# EAGLE design robot (EAGLE 6.4)
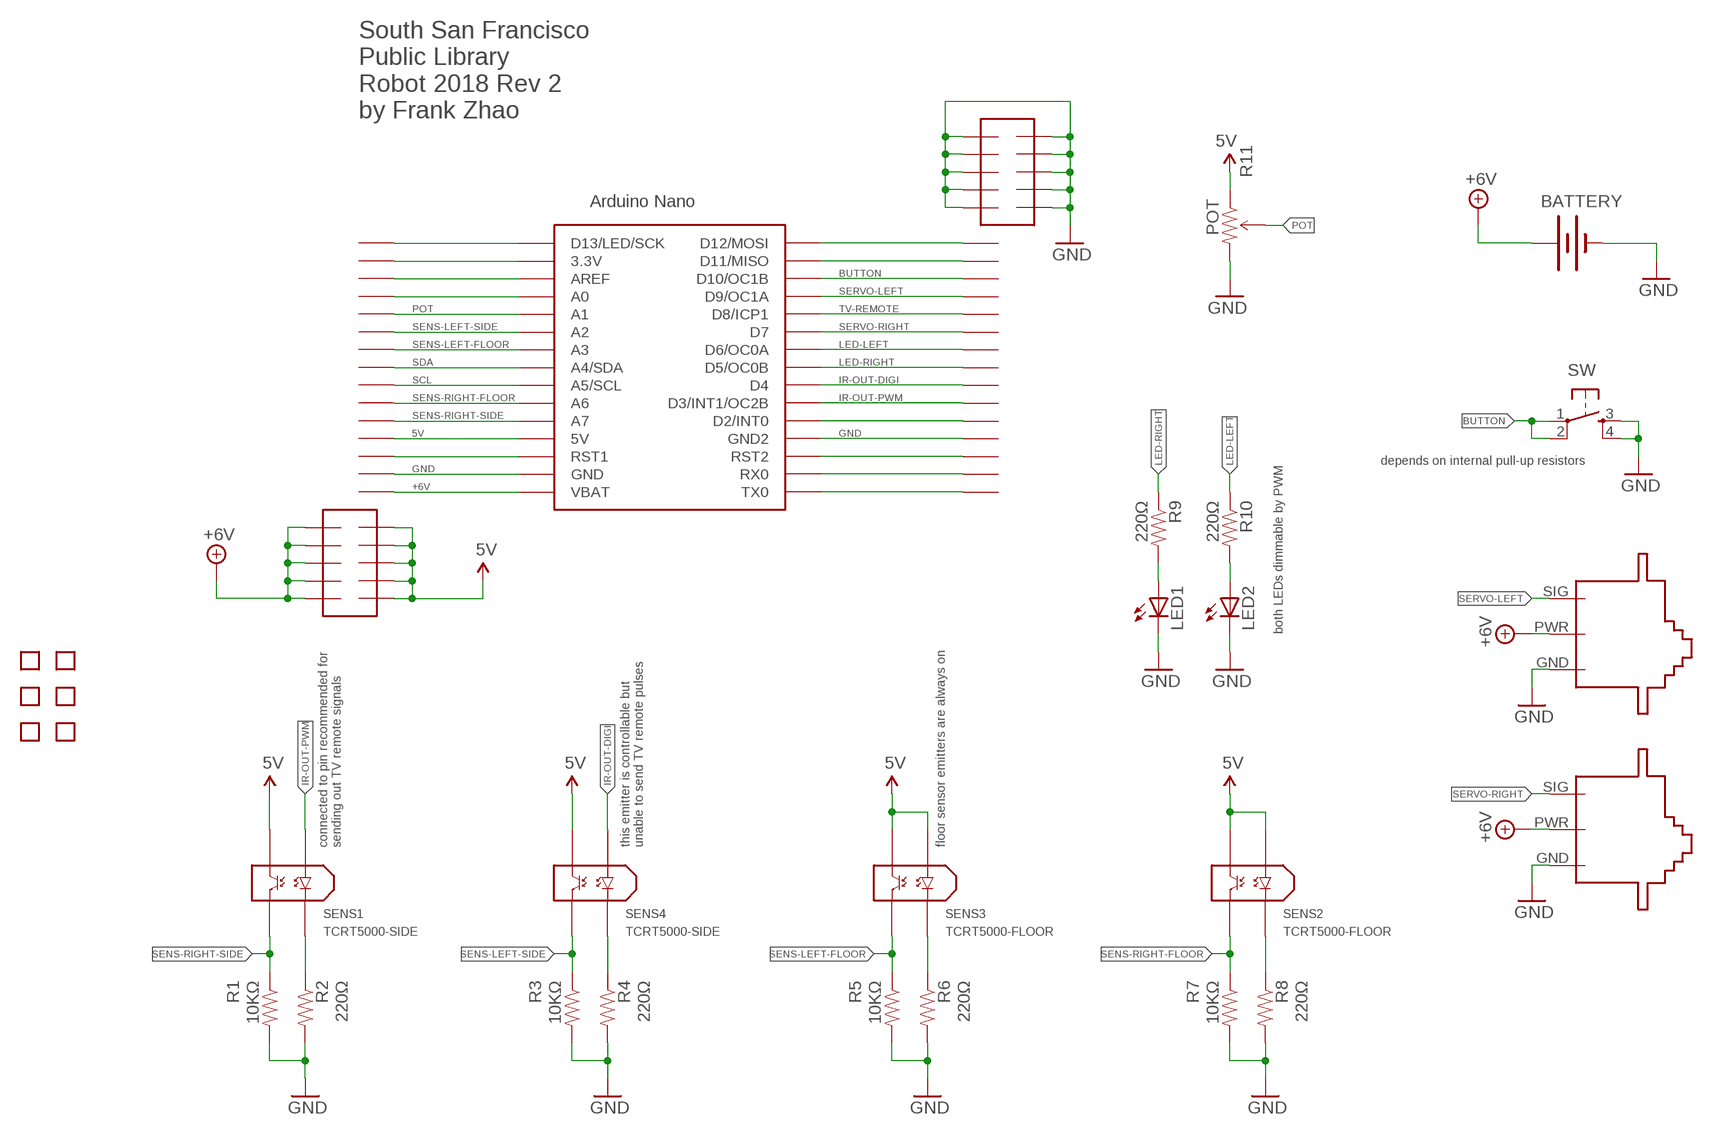
[diagram p0: schematic, sheet 1]

## Parts
BATTERY  BATTERY-WIRE-CONN  [BATT-WIRE-CONN]
LED1  LED5MM  [LED5MM]
LED2  LED5MM  [LED5MM]
M1  SERVO-FLIPPED  [SERVO-FLIPPED]
M2  SERVO-1  [SERVO]
R1  10KΩ  RESISTORAXIAL-0.3  [AXIAL-0.3]
R2  220Ω  RESISTORAXIAL-0.3  [AXIAL-0.3]
R3  10KΩ  RESISTORAXIAL-0.3  [AXIAL-0.3]
R4  220Ω  RESISTORAXIAL-0.3  [AXIAL-0.3]
R5  10KΩ  RESISTORAXIAL-0.3  [AXIAL-0.3]
R6  220Ω  RESISTORAXIAL-0.3  [AXIAL-0.3]
R7  10KΩ  RESISTORAXIAL-0.3  [AXIAL-0.3]
R8  220Ω  RESISTORAXIAL-0.3  [AXIAL-0.3]
R9  220Ω  RESISTORAXIAL-0.3  [AXIAL-0.3]
R10  220Ω  RESISTORAXIAL-0.3  [AXIAL-0.3]
R11  POT  TRIMPOTPTH  [TRIM_POT_PTH]
SENS1  TCRT5000-SIDE  [TCRT5000-SIDE]
SENS2  TCRT5000-FLOOR  [TCRT5000-FLOOR]
SENS3  TCRT5000-FLOOR  [TCRT5000-FLOOR]
SENS4  TCRT5000-SIDE  [TCRT5000-SIDE]
SW  TAC_SWITCHPTH  [TACTILE-PTH]
U5  NANO  [NANO]
U$1  ROBOT-BODY-HOLDER  [ROBOT-BODY-HOLDER]
U$8  PROTO-AREA-MID  [PROTO-AREA-1]
U$9  TEXT-INFO  [TEXT-INFO]
U$10  HOLE  [HOLE-2MM]
U$11  HOLE  [HOLE-2MM]
U$12  HOLE  [HOLE-2MM]
U$13  HOLE  [HOLE-2MM]
X1  NANO-HEADER-SURROUND  [NANO-HEADER-SURROUND]
X2  NANO-HEADER-SURROUND  [NANO-HEADER-SURROUND]

## Nets
5V: R11.1(CCW) SENS1.COL SENS2.AN SENS2.COL SENS3.AN SENS3.COL SENS4.COL U5.5V X2.4 X2.E6 X2.E7 X2.E8 X2.E9 X2.E10
+6V: BATTERY.POS(+) M1.PWR M2.PWR U5.RAW(VBAT) X2.1 X2.E1 X2.E2 X2.E3 X2.E4 X2.E5
A0: U5.A0 X2.12
BUTTON: SW.1 SW.2 U5.D10(D10/OC1B) X1.3
GND: BATTERY.NEG(-) LED1.K(C) LED2.K(C) M1.GND M2.GND R1.P$2 R2.P$2 R3.P$2 R4.P$2 R5.P$2 R6.P$2 R7.P$2 R8.P$2 R11.3(CW) SW.3 SW.4 U5.GND U5.GND1(GND2) X1.12 X1.E1 X1.E2 X1.E3 X1.E4 X1.E5 X1.E6 X1.E7 X1.E8 X1.E9 X1.E10 X2.2
IR-OUT-DIGI: SENS4.AN U5.D4 X1.9
IR-OUT-PWM: SENS1.AN U5.D3(D3/INT1/OC2B) X1.10
LED-LEFT: R10.P$1 U5.D6(D6/OC0A) X1.7
LED-RIGHT: R9.P$1 U5.D5(D5/OC0B) X1.8
N$1: R2.P$1 SENS1.CAT
N$2: R4.P$1 SENS4.CAT
N$3: R6.P$1 SENS3.CAT
N$4: R8.P$1 SENS2.CAT
N$9: LED1.A R9.P$2
N$10: LED2.A R10.P$2
N$11: U5.3.3V X2.14
N$12: U5.AREF X2.13
N$15: U5.RST(RST1) X2.3
N$21: U5.D13(D13/LED/SCK) X2.15
N$26: U5.D12(D12/MOSI) X1.1
N$27: U5.D11(D11/MISO) X1.2
N$36: U5.D2(D2/INT0) X1.11
N$38: U5.RST1(RST2) X1.13
N$39: U5.RX0 X1.14
N$40: U5.TX0 X1.15
POT: R11.2(WIPER) U5.A1 X2.11
SCL: U5.A5(A5/SCL) X2.7
SDA: U5.A4(A4/SDA) X2.8
SENS-LEFT-FLOOR: R5.P$1 SENS3.EM U5.A3 X2.9
SENS-LEFT-SIDE: R3.P$1 SENS4.EM U5.A2 X2.10
SENS-RIGHT-FLOOR: R7.P$1 SENS2.EM U5.A6 X2.6
SENS-RIGHT-SIDE: R1.P$1 SENS1.EM U5.A7 X2.5
SERVO-LEFT: M2.SIG U5.D9(D9/OC1A) X1.4
SERVO-RIGHT: M1.SIG U5.D7 X1.6
TV-REMOTE: U5.D8(D8/ICP1) X1.5

## Notes on the sheet
- depends on internal pull-up resistors
- both LEDs dimmable by PWM
- connected to pin recommended for
  sending out TV remote signals
- this emitter is controllable but
  unable to send TV remote pulses
- floor sensor emitters are always on

## Library data of the parts
BATTERY = robot:BATTERY: Battery Holders Various common sizes : AA, AAA, 20mm coin cell and 12mm coin cell.
LED1 LED2 = robot:LED: LEDs Standard schematic elements and footprints for 5mm, 3mm, 1206, and 0603 sized LEDs. 5mm - Spark Fun Electronics SKU : COM-00529 (and others)
M1 M2 = robot:SERVO
R1-R10 = robot:RESISTOR: Resistor Basic schematic elements and footprints for 0603, 1206, and PTH resistors.
R11 = robot:TRIMPOT
SENS1-SENS4 = robot:TCRT5000
SW = robot:TAC_SWITCH: Momentary Switch Button commonly used for reset or general input. Spark Fun Electronics SKU : COM-00097
U5 = robot:NANO: Arduino Nano
U$1 = robot:ROBOT-BODY-HOLDER
U$8 = robot:PROTO-AREA
U$9 = robot:TEXT-INFO
U$10-U$13 = robot:HOLE
X1 X2 = robot:NANO-HEADER-SURROUND

## Board
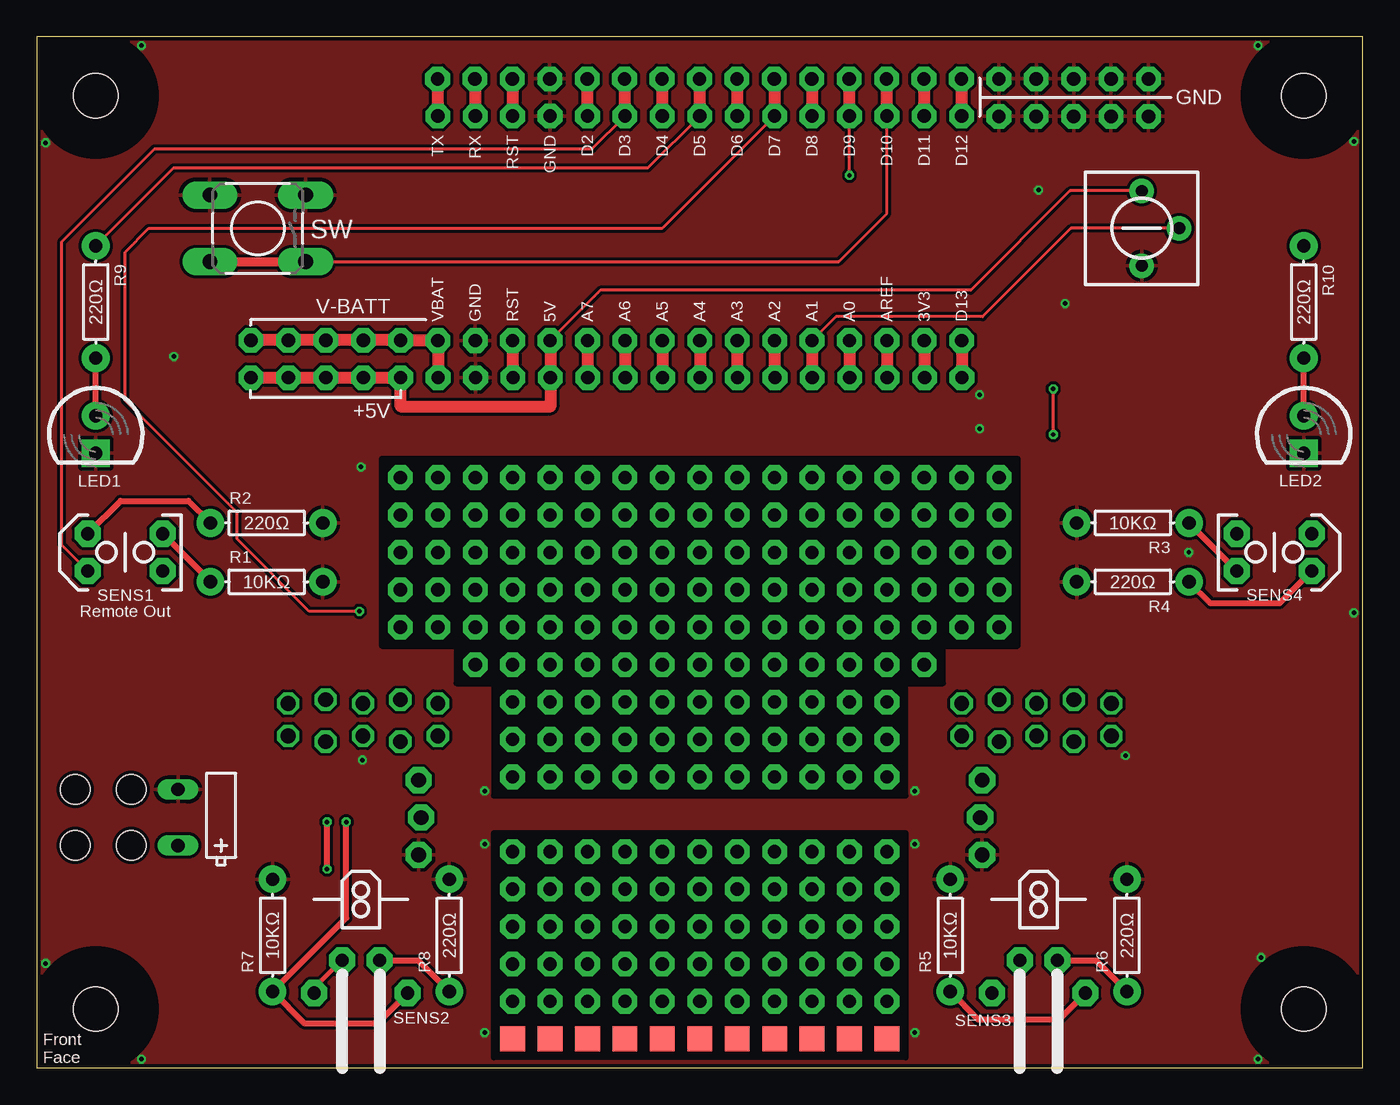
[diagram p1: board, top side]
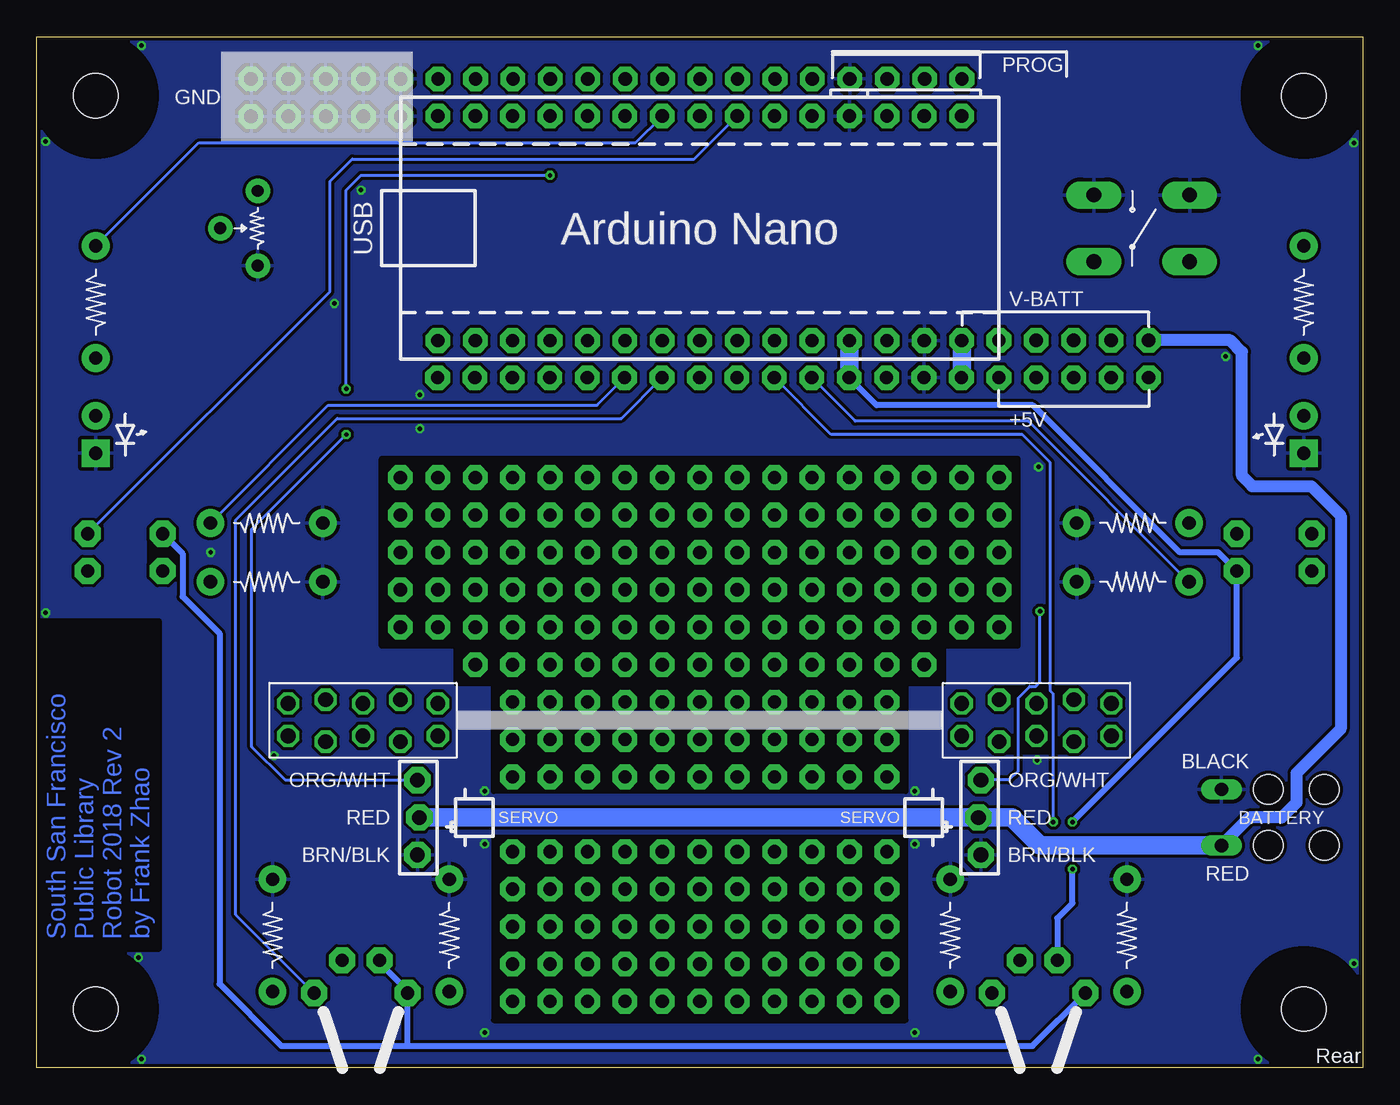
[diagram p2: board, bottom side, seen from below]

Size 90 x 70 mm. Coordinates in mm from the lower left corner, seen from the top.
Outline: 0,0 90,0 90,70 0,70 0,0
Copper layers (1*16): Top 0.035mm / dielectric 1.5mm / Bottom 0.035mm
Design rules "Fusion_eagle_rule_v1.1_TentedVias3": minimum track width 6mil, minimum drill 0.3mm, track to track 7mil, track to pad 7mil, pad to pad 7mil, via to via 7mil, smd to smd 0mil, copper to edge 10mil, drill to drill 10mil, minimum pad ring 10mil, minimum via ring 6mil, stop-mask expansion 2mil, vias tented up to drill 25mil, thermal gap 10mil
bRestrict: 3 lines

### Footprints (pad centres in the part's own frame; a part is rotated, then mirrored left to right if it is on the bottom)
BATT-WIRE-CONN = drill 0.9 long: NEG -6.985,-1.905; POS -6.985,1.905 | hole 2: 0,1.905; 0,-1.905; -3.81,1.905; -3.81,-1.905
LED5MM = drill 0.9 pad 1.88: A -1.27,0 | drill 0.9 pad 1.88 square: K 1.27,0
SERVO-FLIPPED = drill 1 pad 1.778 octagon: GND 2.54,0.089; PWR 0,-0.089; SIG -2.54,0.089
SERVO = drill 1 pad 1.778 octagon: GND -2.54,0.064; PWR 0,-0.064; SIG 2.54,0.064
AXIAL-0.3 = drill 0.9 pad 1.88: P$1 -3.81,0; P$2 3.81,0
TRIM_POT_PTH = drill 0.813 pad 1.676: 1 -2.54,0; 2 0,2.54; 3 2.54,0
TCRT5000-SIDE = drill 0.9 pad 1.778 octagon: AN -2.54,-1.27; CAT -2.54,1.27; COL 2.54,-1.27; EM 2.54,1.27
TCRT5000-FLOOR = drill 0.9 pad 1.778 octagon: AN -1.27,7.303; CAT 1.27,7.303; COL -3.175,5.08; EM 3.175,5.08
TACTILE-PTH = drill 1 pad 1.88 long: 1 -3.251,2.261; 2 3.251,2.261; 3 -3.251,-2.261; 4 3.251,-2.261
NANO = drill 0.9 pad 1.676 octagon: 3.3V -7.62,15.24; 5V -7.62,-10.16; A0 -7.62,10.16; A1 -7.62,7.62; A2 -7.62,5.08; A3 -7.62,2.54; A4 -7.62,0; A5 -7.62,-2.54; A6 -7.62,-5.08; A7 -7.62,-7.62; AREF -7.62,12.7; D2 7.62,-7.62; D3 7.62,-5.08; D4 7.62,-2.54; D5 7.62,0; D6 7.62,2.54; D7 7.62,5.08; D8 7.62,7.62; D9 7.62,10.16; D10 7.62,12.7; D11 7.62,15.24; D12 7.62,17.78; D13 -7.62,17.78; GND -7.62,-15.24; GND1 7.62,-10.16; RAW -7.62,-17.78; RST -7.62,-12.7; RST1 7.62,-12.7; RX0 7.62,-15.24; TX0 7.62,-17.78
ROBOT-BODY-HOLDER = drill 1 octagon: 1 -27.94,1.143; 2 -25.4,1.397; 3 -22.86,1.143; 4 -20.32,1.397; 5 -17.78,1.143; 6 17.78,1.143; 7 20.32,1.397; 8 22.86,1.143; 9 25.4,1.397; 10 27.94,1.143; 11 27.94,-1.067; 12 25.4,-1.448; 13 22.86,-1.067; 14 20.32,-1.448; 15 17.78,-1.067; 16 -17.78,-1.067; 17 -20.32,-1.448; 18 -22.86,-1.067; 19 -25.4,-1.448; 20 -27.94,-1.067
PROTO-AREA-1 = drill 0.9 pad 1.676 octagon: 1 0,0; 2 2.54,0; 3 5.08,0; 4 7.62,0; 5 10.16,0; 6 12.7,0; 7 12.7,-2.54; 8 12.7,-5.08; 9 12.7,-7.62; 10 12.7,2.54; 11 12.7,5.08; 12 15.24,0; 13 -2.54,0; 14 -5.08,0; 15 -7.62,0; 16 -10.16,0; 17 -12.7,0; 18 15.24,-2.54; 19 15.24,-5.08; 20 15.24,-7.62; 21 15.24,2.54; 22 15.24,5.08; 23 17.78,0; 24 17.78,-2.54; 25 17.78,-5.08; 26 12.7,-20.32; 27 17.78,2.54; 28 17.78,5.08; 29 20.32,0; 30 20.32,-2.54; 31 20.32,-5.08; 32 2.54,-20.32; 33 20.32,2.54; 34 20.32,5.08; 35 -20.32,0; 36 -20.32,-2.54; 37 -20.32,-5.08; 38 5.08,-20.32; 39 2.54,2.54; 40 2.54,5.08; 41 -17.78,0; 42 -17.78,-2.54; 43 -17.78,-5.08; 44 7.62,-20.32; 45 -17.78,2.54; 46 5.08,2.54; 47 -15.24,0; 48 -15.24,-2.54; 49 -15.24,-5.08; 50 -15.24,-7.62; 51 -15.24,2.54; 52 -15.24,5.08; 53 5.08,5.08; 54 7.62,2.54; 55 7.62,5.08; 56 10.16,2.54; 57 10.16,5.08; 58 -7.62,2.54; 59 -7.62,5.08; 60 -5.08,2.54; 61 -5.08,5.08; 62 -2.54,2.54; 63 -2.54,5.08; 64 0,2.54; 65 0,5.08; 66 2.54,-2.54; 67 2.54,-5.08; 68 2.54,-7.62; 69 5.08,-2.54; 70 5.08,-5.08; 71 5.08,-7.62; 72 7.62,-2.54; 73 7.62,-5.08; 74 7.62,-7.62; 75 10.16,-2.54; 76 10.16,-5.08; 77 10.16,-7.62; 78 -7.62,-2.54; 79 -7.62,-5.08; 80 -7.62,-7.62; 81 -5.08,-2.54; 82 -5.08,-5.08; 83 -5.08,-7.62; 84 -2.54,-2.54; 85 -2.54,-5.08; 86 -2.54,-7.62; 87 0,-2.54; 88 0,-5.08; 89 0,-7.62; 90 -10.16,2.54; 91 -12.7,2.54; 92 -12.7,5.08; 93 -10.16,5.08; 94 -10.16,-2.54; 95 -10.16,-5.08; 96 -10.16,-7.62; 97 -12.7,-7.62; 98 -12.7,-5.08; 99 -12.7,-2.54; 100 12.7,-10.16; 101 2.54,-10.16; 102 5.08,-10.16; 103 7.62,-10.16; 104 10.16,-10.16; 105 -7.62,-10.16; 106 -5.08,-10.16; 107 -2.54,-10.16; 108 0,-10.16; 109 -10.16,-10.16; 110 -12.7,-10.16; 111 12.7,-12.7; 112 2.54,-12.7; 113 5.08,-12.7; 114 7.62,-12.7; 115 10.16,-12.7; 116 -7.62,-12.7; 117 -5.08,-12.7; 118 -2.54,-12.7; 119 0,-12.7; 120 -10.16,-12.7; 121 -12.7,-12.7; 122 10.16,-20.32; 123 -7.62,-20.32; 124 -5.08,-20.32; 125 -2.54,-20.32; 126 0,-20.32; 127 -10.16,-20.32; 128 -12.7,-20.32; 129 12.7,-15.24; 130 2.54,-15.24; 131 5.08,-15.24; 132 7.62,-15.24; 133 10.16,-15.24; 134 -7.62,-15.24; 135 -5.08,-15.24; 136 -2.54,-15.24; 137 0,-15.24; 138 -10.16,-15.24; 139 -12.7,-15.24; 140 12.7,-22.86; 141 2.54,-22.86; 142 5.08,-22.86; 143 7.62,-22.86; 144 10.16,-22.86; 145 -7.62,-22.86; 146 -5.08,-22.86; 147 -2.54,-22.86; 148 0,-22.86; 149 -10.16,-22.86; 150 -12.7,-22.86; 151 12.7,-25.4; 152 2.54,-25.4; 153 5.08,-25.4; 154 7.62,-25.4; 155 10.16,-25.4; 156 -7.62,-25.4; 157 -5.08,-25.4; 158 -2.54,-25.4; 159 0,-25.4; 160 -10.16,-25.4; 161 -12.7,-25.4; 162 12.7,-27.94; 163 2.54,-27.94; 164 5.08,-27.94; 165 7.62,-27.94; 166 10.16,-27.94; 167 -7.62,-27.94; 168 -5.08,-27.94; 169 -2.54,-27.94; 170 0,-27.94; 171 -10.16,-27.94; 172 -12.7,-27.94; 173 12.7,-30.48; 174 2.54,-30.48; 175 5.08,-30.48; 176 7.62,-30.48; 177 10.16,-30.48; 178 -7.62,-30.48; 179 -5.08,-30.48; 180 -2.54,-30.48; 181 0,-30.48; 182 -10.16,-30.48; 183 -12.7,-30.48; 184 -17.78,5.08; 185 -20.32,5.08; 186 -20.32,2.54 | smd 1.676 x 1.676: P$1 -12.7,-33.02; P$2 -10.16,-33.02; P$3 -7.62,-33.02; P$4 -5.08,-33.02; P$5 -2.54,-33.02; P$6 0,-33.02; P$7 2.54,-33.02; P$8 5.08,-33.02; P$9 7.62,-33.02; P$10 10.16,-33.02; P$11 12.7,-33.02
HOLE-2MM = hole 3: 0,0
NANO-HEADER-SURROUND = drill 0.9 pad 1.676 octagon: 1 -2.54,-2.54; 2 -5.08,-2.54; 3 -7.62,-2.54; 4 -10.16,-2.54; 5 -12.7,-2.54; 6 -15.24,-2.54; 7 -17.78,-2.54; 8 -20.32,-2.54; 9 -22.86,-2.54; 10 -25.4,-2.54; 11 -27.94,-2.54; 12 -30.48,-2.54; 13 -33.02,-2.54; 14 -35.56,-2.54; 15 -38.1,-2.54; E1 0,0; E2 2.54,0; E3 5.08,0; E4 7.62,0; E5 10.16,0; E6 10.16,-2.54; E7 7.62,-2.54; E8 5.08,-2.54; E9 2.54,-2.54; E10 0,-2.54

### Placement (x,y rotation side)
BATTERY  2.6,17 180 top
LED1  4,43 270 top
LED2  86,43 270 top
M1  26,17 270 bottom
M2  64.1,17 90 bottom
R1  15.6,33 0 top
R2  15.6,37 0 top
R3  74.4,37 180 top
R4  74.4,33 180 top
R5  62,9 90 top
R6  74,9 90 top
R7  16,9 90 top
R8  28,9 90 top
R9  4,52 270 top
R10  86,52 270 top
R11  75,57 270 top
SENS1  6,35 0 top
SENS2  22,0 0 top
SENS3  68,0 0 top
SENS4  84,35 180 top
SW  15,57 180 top
U5  45,57 90 bottom
U$1  45,23.6 0 bottom
U$8  45,35 0 top
U$9  81.7,8.1 90 bottom
U$10  4,4 0 top
U$11  4,66 0 top
U$12  86,4 0 top
U$13  86,66 0 top
X1  65.3,64.6 180 bottom
X2  24.7,49.4 0 bottom

### Tracks (layer width: path | path; a pad name or v marks a point on that pad's centre or on a via)
5V  (via drill 0.3)
  Top 0.203: 34.86,49.34 34.84,49.36 U5.5V 38.26,52.8 63.4,52.8 70.14,59.54 R11.1
  Top 0.305: SENS2.COL 18.82,5.42 20.73,7.33 SENS2.AN
  Top 0.406: v19.7,13.5 v19.7,16.7
  Top 0.813: X2.E6 X2.E7 X2.E8 X2.E9 X2.E10 24.7,44.9 34.86,44.9 X2.4 | 34.82,49.38 34.86,49.34 34.86,46.88
  Bottom 0.406: 64.83,1.5 22.41,1.5 SENS2.COL | SENS4.COL 80.1,34.91 80.1,32 77.6,29.5 77.6,5.7 73.4,1.5 64.83,1.5 | X2.4 33,45 22.4,45 12.4,35 9.81,35 SENS1.COL 8.54,27.86 v19.7,16.7 | v19.7,13.5 19.7,11.19 20.73,10.16 SENS2.AN | SENS3.AN 66.73,7.13 64.83,5.22 SENS3.COL 64.83,1.5
  Bottom 1.27: U5.5V 34.84,46.88 X2.4
+6V
  Top 0.813: X2.E5 X2.E4 X2.E3 X2.E2 X2.E1 24.72,49.38 U5.RAW 27.24,49.36 X2.1
  Bottom 0.813: BATTERY.POS 7.68,17 5.5,17 4.5,18 4.5,20 1.5,23 1.5,37.5 3.5,39.5 7.5,39.5 8.2,40.2 8.2,48.6 9,49.4 X2.E5
  Bottom 1.27: U5.RAW 27.22,46.86 X2.1 | BATTERY.POS 21.89,15.1 23.8,17 M1.PWR M2.PWR
A0
  Top 0.813: U5.A0 55.16,46.88 X2.12
BUTTON
  Top 0.203: SW.1 54.44,54.74 57.7,58 U5.D10
  Top 0.61: SW.2 SW.1
  Top 0.813: X1.3 57.68,64.64 U5.D10
GND  (via drill 0.3)
  other vias: 30.4,2.4 59.6,2.4 30.4,15.2 59.6,15.2 59.6,18.8 30.4,18.8 22,40.8 9.3,48.3 78.2,35 69.8,51.9 68,59.6 73.9,21.2 22.1,20.9 7.1,69.4 82.9,69.4 89.4,62.9 0.6,62.8 7.1,0.6 0.6,7.1 82.9,0.6 83.1,7.5 89.4,30.9 64,45.7 64,43.4
  pour Bottom (isolate 0.203): 0,0 90,0 90,70 0,70
  pour Top (isolate 0.203): 0,0 90,0 90,70 0,70
IR-OUT-DIGI
  Top 0.813: X1.9 42.44,64.64 U5.D4
  Bottom 0.203: SENS4.AN 70.1,52.71 70.1,60.2 68.6,61.7 45.38,61.7 U5.D4
IR-OUT-PWM
  Top 0.203: SENS1.AN 1.7,35.49 1.7,56.1 8,62.4 37.7,62.4 U5.D3
  Top 0.813: X1.10 39.9,64.64 U5.D3
LED-LEFT
  Top 0.813: X1.7 47.52,64.64 U5.D6
  Bottom 0.203: R10.P$1 79.01,62.8 49.36,62.8 U5.D6
LED-RIGHT
  Top 0.203: R9.P$1 9.29,61.1 41.48,61.1 U5.D5
  Top 0.813: X1.8 44.98,64.64 U5.D5
N$1
  Top 0.406: SENS1.CAT 5.69,38.5 10.29,38.5 R2.P$1
N$2
  Top 0.406: SENS4.CAT 84.34,31.54 79.67,31.54 R4.P$1
N$3
  Top 0.406: SENS3.CAT 71.89,7.3 R6.P$1
N$4
  Top 0.406: SENS2.CAT 25.89,7.3 R8.P$1
N$9
  Top 0.406: LED1.A R9.P$2
N$10
  Top 0.406: LED2.A R10.P$2
N$11
  Top 0.813: U5.3.3V 60.24,46.88 X2.14
N$12
  Top 0.813: U5.AREF 57.7,46.88 X2.13
N$15
  Top 0.813: U5.RST 32.3,46.88 X2.3
N$21
  Top 0.813: U5.D13 62.78,46.88 X2.15
N$26
  Top 0.813: X1.1 62.76,64.64 U5.D12
N$27
  Top 0.813: X1.2 60.22,64.64 U5.D11
N$36
  Top 0.813: X1.11 37.36,64.64 U5.D2
N$38
  Top 0.813: X1.13 32.28,64.64 U5.RST1
N$39
  Top 0.813: X1.14 29.74,64.64 U5.RX0
N$40
  Top 0.813: X1.15 27.2,64.64 U5.TX0
POT
  Top 0.203: U5.A1 54.24,51 64.2,51 70.2,57 R11.2
  Top 0.813: U5.A1 52.62,46.88 X2.11
SCL
  Top 0.813: U5.A5 42.46,46.88 X2.7
SDA
  Top 0.813: U5.A4 45,46.88 X2.8
SENS-LEFT-FLOOR
  Top 0.406: R5.P$1 63.89,3.3 69.39,3.3 SENS3.EM
  Top 0.813: U5.A3 47.54,46.88 X2.9
  Bottom 0.203: X2.9 50.32,44.1 69.6,44.1 76.5,37.2 76.5,10.4 SENS3.EM
SENS-LEFT-SIDE
  Top 0.406: SENS4.EM 81.46,33.75 R3.P$1
  Top 0.813: U5.A2 50.08,46.88 X2.10
  Bottom 0.203: R3.P$1 70.21,45 51.96,45 X2.10
SENS-RIGHT-FLOOR  (via drill 0.3)
  Top 0.406: v21,16.7 21,10.19 R7.P$1 18.19,3 23.09,3 SENS2.EM
  Top 0.813: U5.A6 39.92,46.88 X2.6
  Bottom 0.203: X2.6 36.08,43 23.11,43 21.2,41.09 21.2,25.6 21,25.4 v21,16.7
SENS-RIGHT-SIDE
  Top 0.406: SENS1.EM 11.19,33.62 R1.P$1
  Top 0.813: U5.A7 37.38,46.88 X2.5
  Bottom 0.203: X2.5 34.44,43.9 22.7,43.9 R1.P$1
SERVO-LEFT  (via drill 0.3)
  Top 0.203: v69,43 v69,46.1 | v55.16,60.6 U5.D9
  Top 0.813: X1.4 55.14,64.64 U5.D9
  Bottom 0.203: v69,43 75.4,36.6 75.4,21.8 73.14,19.54 M2.SIG | v69,46.1 69,59.6 68,60.6 v55.16,60.6
SERVO-RIGHT  (via drill 0.3)
  Top 0.203: v21.9,31 18.5,31 13.6,35.9 13.6,37.7 6,45.3 6,55.4 7.6,57 42.46,57 U5.D7
  Top 0.813: X1.6 50.06,64.64 U5.D7
  Bottom 0.203: M1.SIG 24,19.54 23.4,20.14 23.4,25.1 22.6,25.9 22.2,25.9 21.9,26.2 v21.9,31
TV-REMOTE
  Top 0.813: X1.5 52.6,64.64 U5.D8

### Text on the board
tPlace: GND | V-BATT | +5V | Remote Out | Front / Face
bPlace: PROG | GND | V-BATT | +5V | Rear